# EAGLE design scheme (EAGLE 7.2.0)

## Sheet 1 of 2
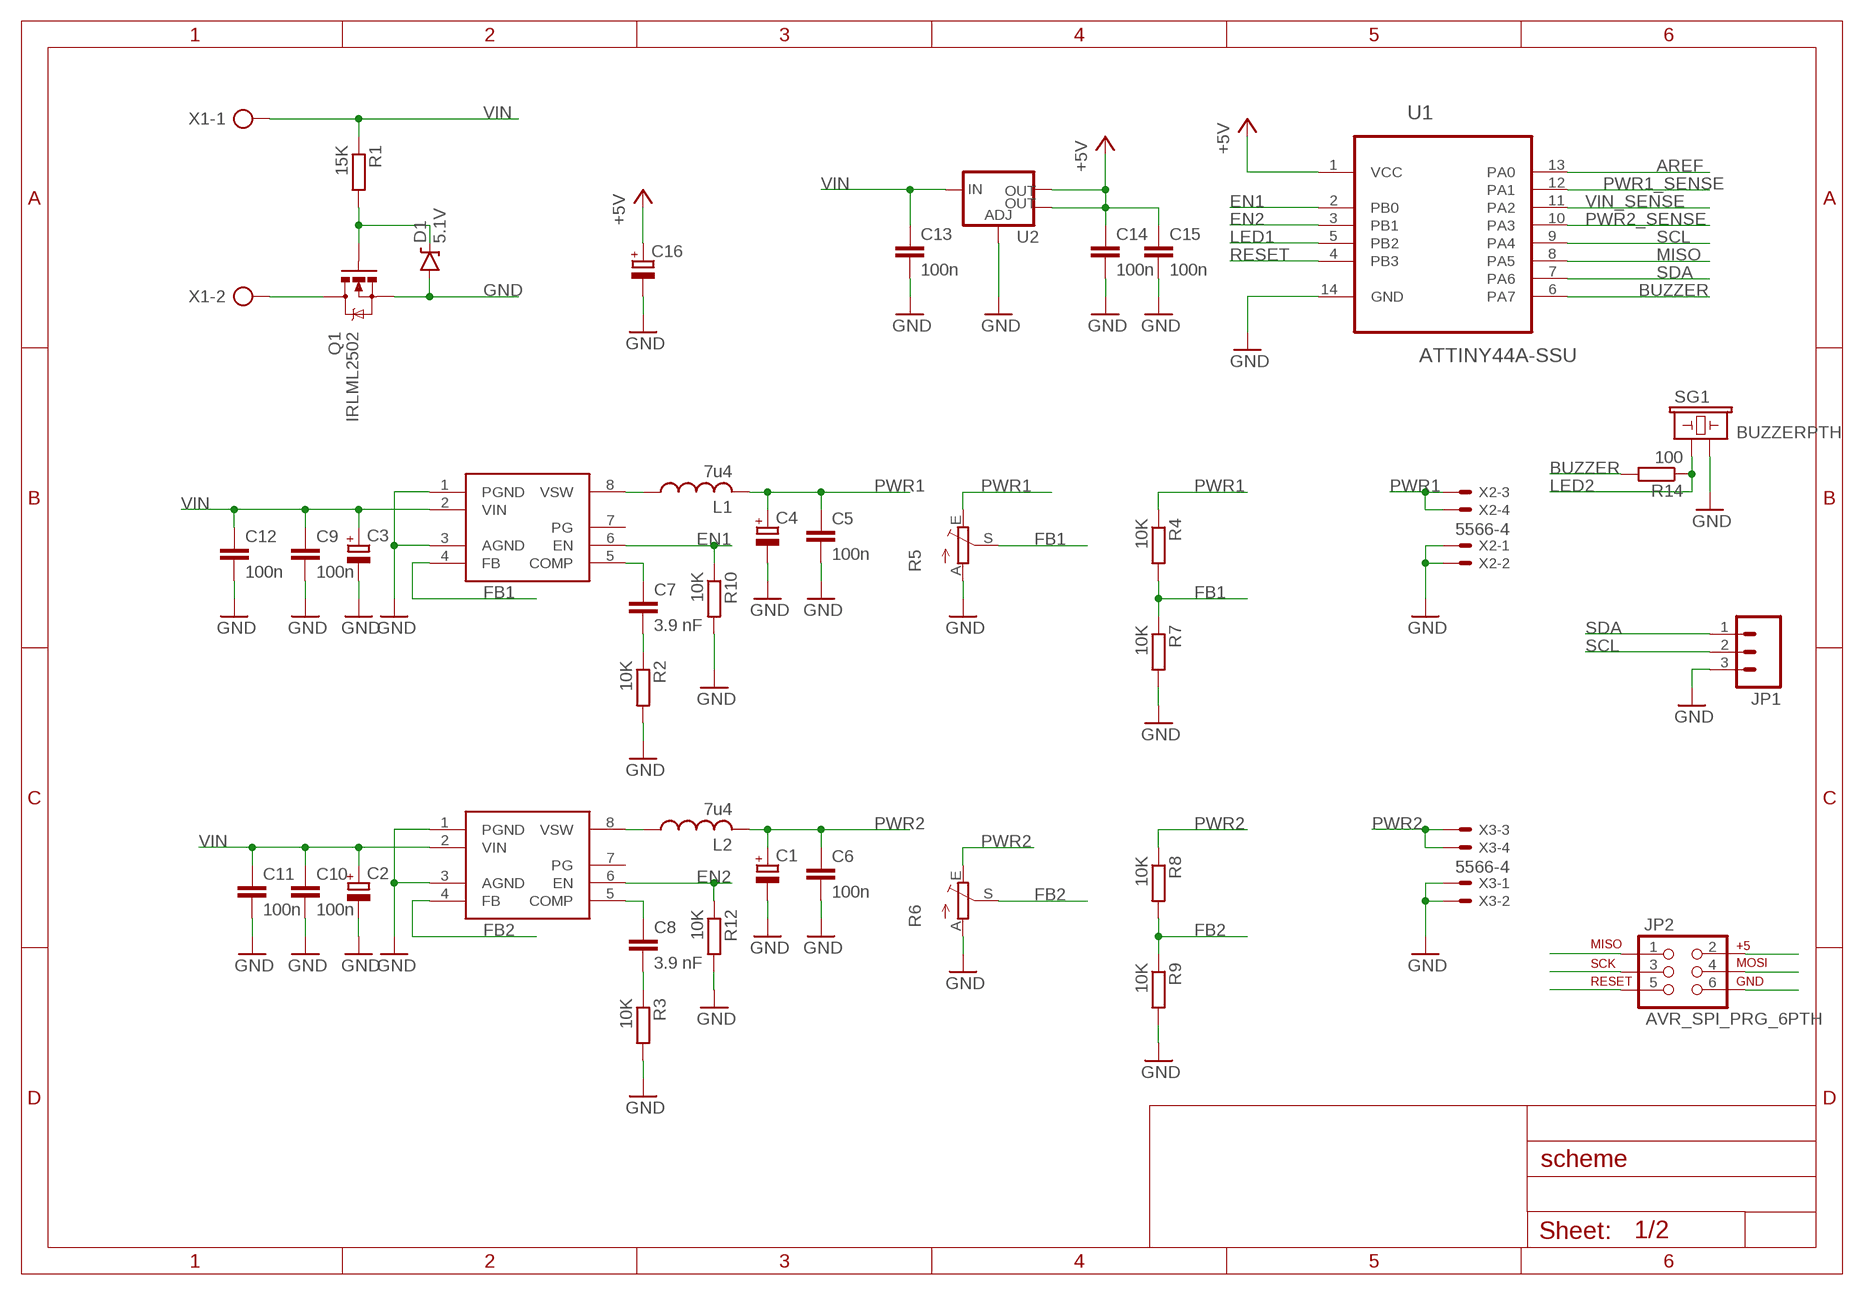
[diagram p0: schematic, sheet 1]

### Parts
C1  CPOL-EUD/7343-31R  [D/7343-31R]
C2  CPOL-EUD/7343-31R  [D/7343-31R]
C3  CPOL-EUD/7343-31R  [D/7343-31R]
C4  CPOL-EUD/7343-31R  [D/7343-31R]
C5  100n  C-EUC0805  [C0805]
C6  100n  C-EUC0805  [C0805]
C7  3.9 nF  C-EUC0805  [C0805]
C8  3.9 nF  C-EUC0805  [C0805]
C9  100n  C-EUC0805  [C0805]
C10  100n  C-EUC0805  [C0805]
C11  100n  C-EUC0805  [C0805]
C12  100n  C-EUC0805  [C0805]
C13  100n  C-EUC0805  [C0805]
C14  100n  C-EUC0805  [C0805]
C15  100n  C-EUC0805  [C0805]
C16  CPOL-EUD/7343-31R  [D/7343-31R]
D1  5.1V  DIODE-ZENER5.6V  [SOD-323]
JP1  M03PTH  [1X03]
JP2  AVR_SPI_PRG_6PTH  [2X3]
L1  7u4  L-USCDRH6D38  [CDRH6D38]
L2  7u4  L-USCDRH6D38  [CDRH6D38]
Q1  IRLML2502  MOSFET-NCHANNELAO3404A  [SOT23-3]
R1  15K  R-EU_R0805  [R0805]
R2  10K  R-EU_R0805  [R0805]
R3  10K  R-EU_R0805  [R0805]
R4  10K  R-EU_R0805  [R0805]
R5  TRIM_EU-RJ9W  [RJ9W]
R6  TRIM_EU-RJ9W  [RJ9W]
R7  10K  R-EU_R0805  [R0805]
R8  10K  R-EU_R0805  [R0805]
R9  10K  R-EU_R0805  [R0805]
R10  10K  R-EU_R0805  [R0805]
R12  10K  R-EU_R0805  [R0805]
R14  100  R-EU_R0805  [R0805]
SG1  BUZZERPTH  [BUZZER-12MM]
U1  ATTINY44A-SSU  [SOIC127P600X175-14N]
U2  V_REG_LM1117SOT223  [SOT223]
U$1  NCP3170  [SO08]
U$2  NCP3170  [SO08]
X1  AK500/2  [AK500/2]
X2  5566-4  [5566-4]
X3  5566-4  [5566-4]

### Nets
+5V: C14.1 C15.1 C16.+ JP2.2 U1.1(VCC) U2.2(OUT) U2.4(OUT) ; also sheet 2
AREF: U1.13(PA0) ; also sheet 2
BUZZER: R14.2 U1.6(PA7)
EN1: R10.1 U1.2(PB0) U$2.6(EN)
EN2: R12.1 U1.3(PB1) U$1.6(EN)
FB1: R4.2 R5.S R7.1 U$2.4(FB)
FB2: R6.S R8.2 R9.1 U$1.4(FB)
GND: C1.- C2.- C3.- C4.- C5.2 C6.2 C9.2 C10.2 C11.2 C12.2 C13.2 C14.2 C15.2 C16.- D1.A JP1.3 JP2.6 Q1.2(S) R2.2 R3.2 R5.A R6.A R7.2 R9.2 R10.2 R12.2 SG1.- U1.14(GND) U2.1(ADJ) U$1.1(PGND) U$1.3(AGND) U$2.1(PGND) U$2.3(AGND) X2.1 X2.2 X3.1 X3.2 ; also sheet 2
LED1: U1.5(PB2) ; also sheet 2
LED2: R14.1 SG1.+ ; also sheet 2
MISO: JP2.1 U1.8(PA5) ; also sheet 2
N$1: Q1.3(D) X1.2
N$2: L1.1 U$2.8(VSW)
N$3: D1.C Q1.1(G) R1.2
N$4: L2.1 U$1.8(VSW)
N$5: C7.1 U$2.5(COMP)
N$6: C8.1 U$1.5(COMP)
N$7: C7.2 R2.1
N$8: C8.2 R3.1
PWR1: C4.+ C5.1 L1.2 R4.1 R5.E X2.3 X2.4 ; also sheet 2
PWR1_SENSE: U1.12(PA1) ; also sheet 2
PWR2: C1.+ C6.1 L2.2 R6.E R8.1 X3.3 X3.4 ; also sheet 2
PWR2_SENSE: U1.10(PA3) ; also sheet 2
RESET: JP2.5 U1.4(PB3)
SCL: JP1.2 JP2.3 U1.9(PA4)
SDA: JP1.1 JP2.4 U1.7(PA6)
VIN: C2.+ C3.+ C9.1 C10.1 C11.1 C12.1 C13.1 R1.1 U2.3(IN) U$1.2(VIN) U$2.2(VIN) X1.1 ; also sheet 2
VIN_SENSE: U1.11(PA2) ; also sheet 2
Unconnected: U$1.7(PG) U$2.7(PG)

## Sheet 2 of 2
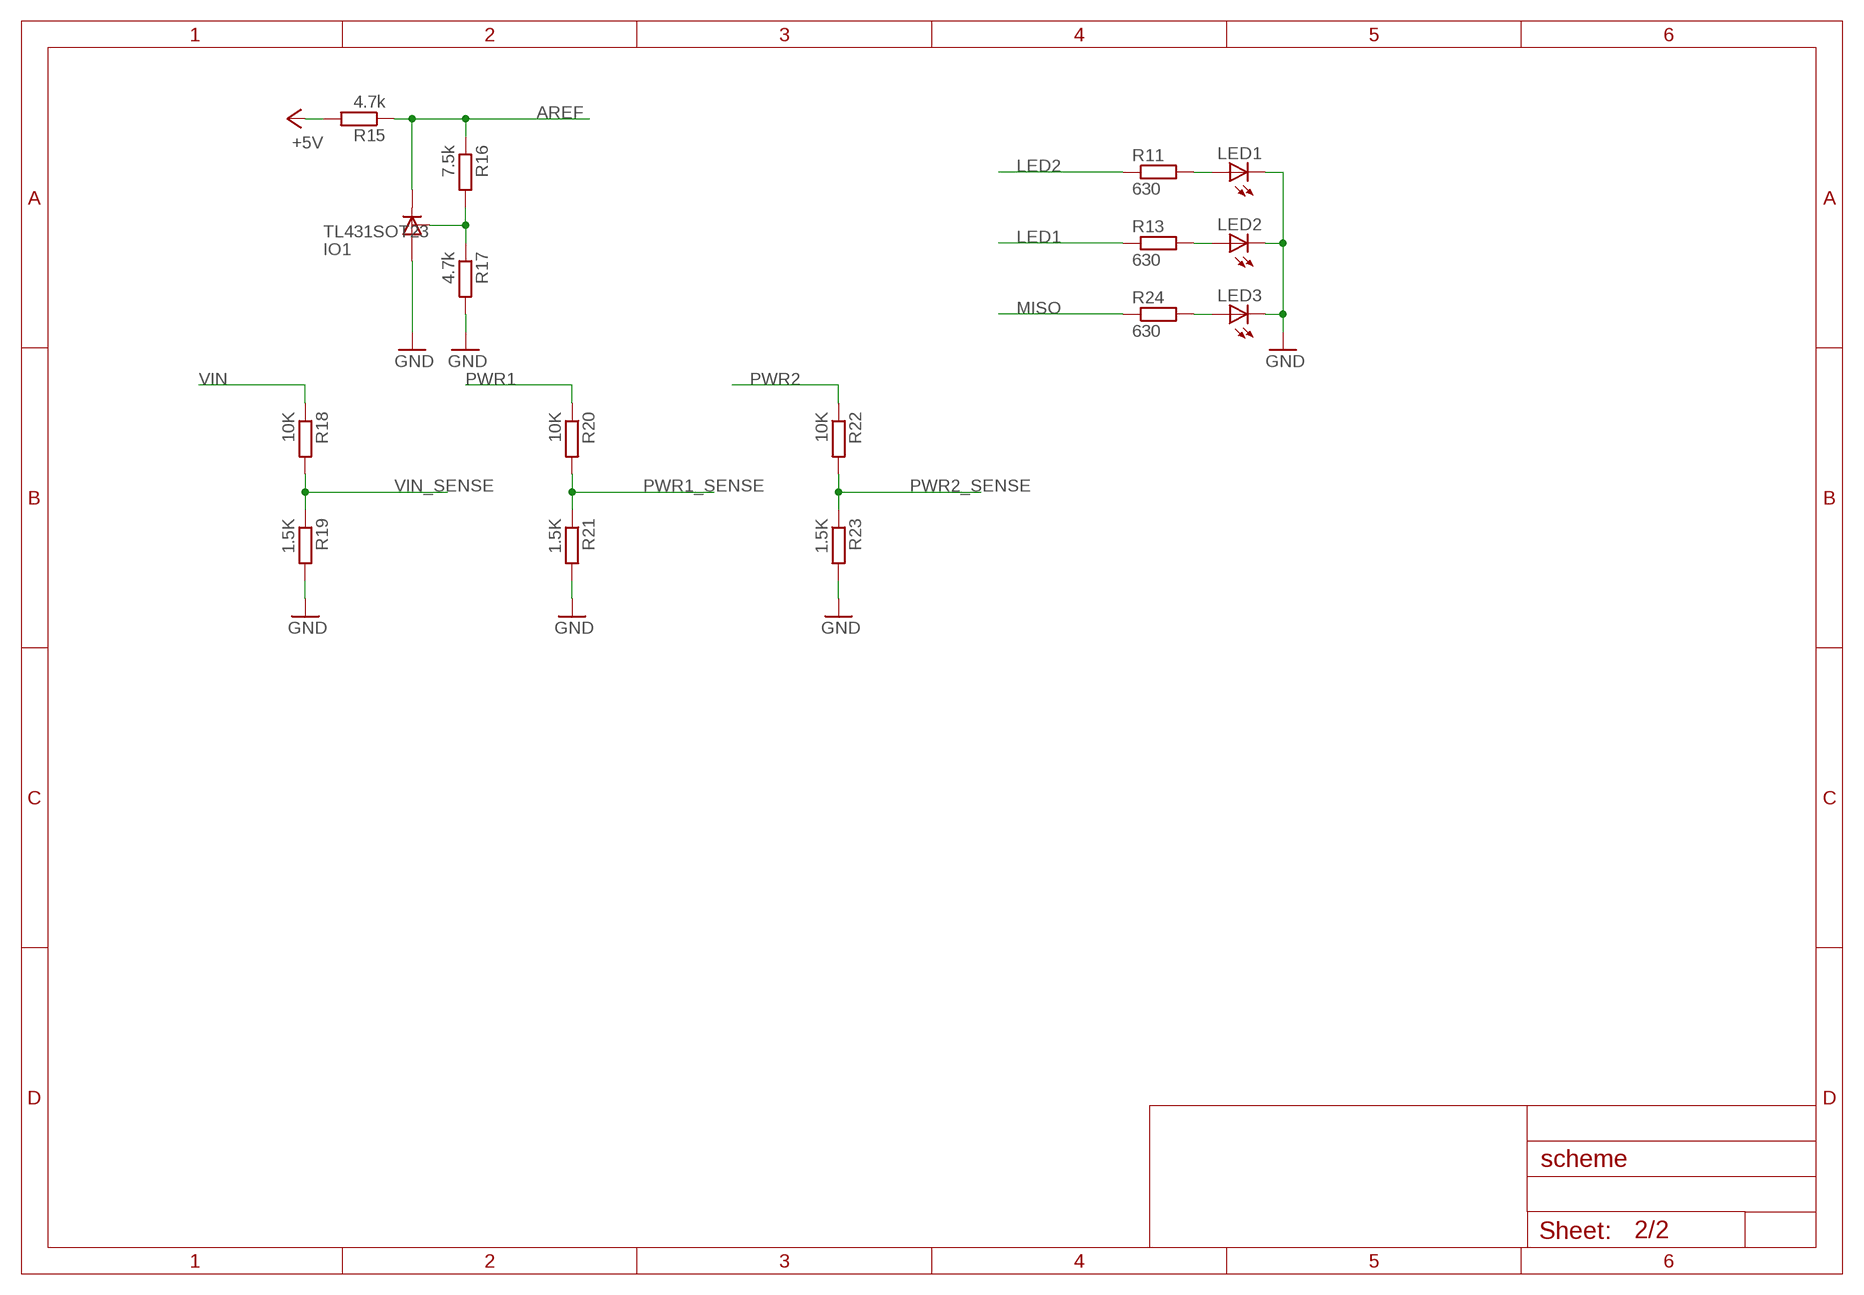
[diagram p1: schematic, sheet 2]

### Parts
IO1  TL431SOT23  [SOT23]
LED1  LEDCHIPLED_0805  [CHIPLED_0805]
LED2  LEDCHIPLED_0805  [CHIPLED_0805]
LED3  LEDCHIPLED_0805  [CHIPLED_0805]
R11  630  R-EU_R0805  [R0805]
R13  630  R-EU_R0805  [R0805]
R15  4.7k  R-EU_R0805  [R0805]
R16  7.5k  R-EU_R0805  [R0805]
R17  4.7k  R-EU_R0805  [R0805]
R18  10K  R-EU_R0805  [R0805]
R19  1.5K  R-EU_R0805  [R0805]
R20  10K  R-EU_R0805  [R0805]
R21  1.5K  R-EU_R0805  [R0805]
R22  10K  R-EU_R0805  [R0805]
R23  1.5K  R-EU_R0805  [R0805]
R24  630  R-EU_R0805  [R0805]

### Nets
+5V: R15.2 ; also sheet 1
AREF: IO1.1(C) R15.1 R16.1 ; also sheet 1
GND: IO1.3(A) LED1.C LED2.C LED3.C R17.2 R19.2 R21.2 R23.2 ; also sheet 1
LED1: R13.1 ; also sheet 1
LED2: R11.1 ; also sheet 1
MISO: R24.1 ; also sheet 1
N$10: LED1.A R11.2
N$11: IO1.2(R) R16.2 R17.1
N$12: LED2.A R13.2
N$13: LED3.A R24.2
PWR1: R20.1 ; also sheet 1
PWR1_SENSE: R20.2 R21.1 ; also sheet 1
PWR2: R22.1 ; also sheet 1
PWR2_SENSE: R22.2 R23.1 ; also sheet 1
VIN: R18.1 ; also sheet 1
VIN_SENSE: R18.2 R19.1 ; also sheet 1

## Library data of the parts
C1-C4 C16 = rcl:CPOL-EU: POLARIZED CAPACITOR, European symbol
C5-C15 = rcl:C-EU: CAPACITOR, European symbol
D1 = SparkFun-DiscreteSemi:DIODE-ZENER: Zener Diode Production Part - 8199 3.4V Zener Voltage; PROD_ID: DIO-12442; VALUE: 5.6V
IO1 = references:TL431: Programmable Shunt Regulator TL431 Features > Programmable Output Voltage to 36 Volts > Low Dynamic Output Impedance 0.2? Typical > Sink Current Capability of 1.0 to 100mA > Equivalent Full-Range Temperature Coefficient of 50ppm/°C Typical > Temperature Compensated For Operation Over Full Rated Operating Temperature Range > Low Output Noise Voltage > Fast Turn-on Response; MPN: TL431BFDT; OC_FARNELL: 2095471; PACKAGE: SOT23; SUPPLIER: NXP
JP1 = SparkFun-Connectors:M03: Header 3 Standard 3-pin 0.1" header. Use with straight break away headers (SKU : PRT-00116), right angle break away headers (PRT-00553), swiss pins (PRT-00743), machine pins (PRT-00117), and female headers (PRT-00115). Molex polarized connector foot print use with SKU : PRT-08232 with associated crimp pins and housings.
JP2 = SparkFun-Connectors:AVR_SPI_PRG_6: AVR ISP 6 Pin This is the reduced ISP connector for AVR programming. Common on Arduino. This footprint will take up less PCB space and can be used with a 10-pin to 6-pin adapter such as SKU: BOB-08508 **Special note about "TEST_POINT" package. The stop mask is on the top side, so if you want your programming test points to be on the bottom of your board, make sure to place this package on the bottom side of the board. This also ensure that the orientation to program from the bottom side will be correct.
L1 L2 = rokkit:L-US: INDUCTOR, American symbol
LED1-LED3 = led:LED: LED OSRAM: - CHIPLED LG R971, LG N971, LY N971, LG Q971, LY Q971, LO R971, LY R971 LH N974, LH R974 LS Q976, LO Q976, LY Q976 LO Q996 - Hyper CHIPLED LW Q18S LB Q993, LB Q99A, LB R99A - SideLED LS A670, LO A670, LY A670, LG A670, LP A670 LB A673, LV A673, LT A673, LW A673 LH A674 LY A675 LS A676, LA A676, LO A676, LY A676, LW A676 LS A679, LY A679, LG A679 - Hyper Micro SIDELED® LS Y876, LA Y876, LO Y876, LY Y876 LT Y87S - SmartLED LW L88C, LW L88S LB L89C, LB L89S, LG L890 LS L89K, LO L89K, LY L89K LS L896, LA L896, LO L896, LY L896 - TOPLED LS T670, LO T670, LY T670, LG T670, LP T670 LSG T670, LSP T670, LSY T670, LOP T670, LYG T670 LG T671, LOG T671, LSG T671 LB T673, LV T673, LT T673, LW T673 LH T674 LS T676, LA T676, LO T676, LY T676, LB T676, LH T676, LSB T676, LW T676 LB T67C, LV T67C, LT T67C, LS T67K, LO T67K, LY T67K, LW E67C LS E67B, LA E67B, LO E67B, LY E67B, LB E67C, LV E67C, LT E67C LW T67C LS T679, LY T679, LG T679 LS T770, LO T770, LY T770, LG T770, LP T770 LB T773, LV T773, LT T773, LW T773 LH T774 LS E675, LA E675, LY E675, LS T675 LS T776, LA T776, LO T776, LY T776, LB T776 LHGB T686 LT T68C, LB T68C - Hyper Mini TOPLED® LB M676 - Mini TOPLED Santana® LG M470 LS M47K, LO M47K, LY M47K Source: http://www.osram.convergy.de LUXEON: - LUMILED® LXK2-PW12-R00, LXK2-PW12-S00, LXK2-PW14-U00, LXK2-PW14-V00 LXK2-PM12-R00, LXK2-PM12-S00, LXK2-PM14-U00 LXK2-PE12-Q00, LXK2-PE12-R00, LXK2-PE12-S00, LXK2-PE14-T00, LXK2-PE14-U00 LXK2-PB12-K00, LXK2-PB12-L00, LXK2-PB12-M00, LXK2-PB14-N00, LXK2-PB14-P00, LXK2-PB14-Q00 LXK2-PR12-L00, LXK2-PR12-M00, LXK2-PR14-Q00, LXK2-PR14-R00 LXK2-PD12-Q00, LXK2-PD12-R00, LXK2-PD12-S00 LXK2-PH12-R00, LXK2-PH12-S00 LXK2-PL12-P00, LXK2-PL12-Q00, LXK2-PL12-R00 Source: www.luxeon.com KINGBRIGHT: KA-3528ASYC Source: www.kingbright.com
Q1 = SparkFun-DiscreteSemi:MOSFET-NCHANNEL: Common NMOSFET Parts MFG P/N Store ID Prod ID FDD8780 TRANS-09984 SI7820DN TRANS-11055 FDS6630A IC-08089 2N7002PW TRANS-11151 FQP30N06L COM-10213 TRANS-10060 BSS123LT1G TRANS-08345 BSS138 TRANS-00830 BS170 2N7000; PROD_ID: TRAN-12988
R1-R4 R7-R24 = rcl:R-EU_: RESISTOR, European symbol
R5 R6 = pot:TRIM_EU-: POTENTIOMETER
SG1 = SparkFun-Electromechanical:BUZZER: Buzzer 12mm Spark Fun Electronics SKU : Comp-Buzzer
U1 = Atmel_By_element14_Batch_1-00:ATTINY44A-SSU: 8-bit Microcontroller with In-System Programmable Flash; MPN: ATTINY44A-SSU; OC_FARNELL: 1699397; OC_NEWARK: 80P3683; PACKAGE: SOIC-14; SUPPLIER: Atmel
U2 = SparkFun-PowerIC:V_REG_LM1117: Voltage Regulator LM1117 Standard adjustable voltage regulator but in SMD form. Spark Fun Electronics SKU : COM-00595; PROD_ID: VREG-08170
U$1 U$2 = rokkit:NCP3170
X1 = con-ptr500:AK500/2: CONNECTOR; OC_FARNELL: unknown; OC_NEWARK: unknown
X2 X3 = con-molex:5566-4: Mini FIT connector 4 pol Source: http://www.molex.com; OC_FARNELL: unknown; OC_NEWARK: unknown

## Board
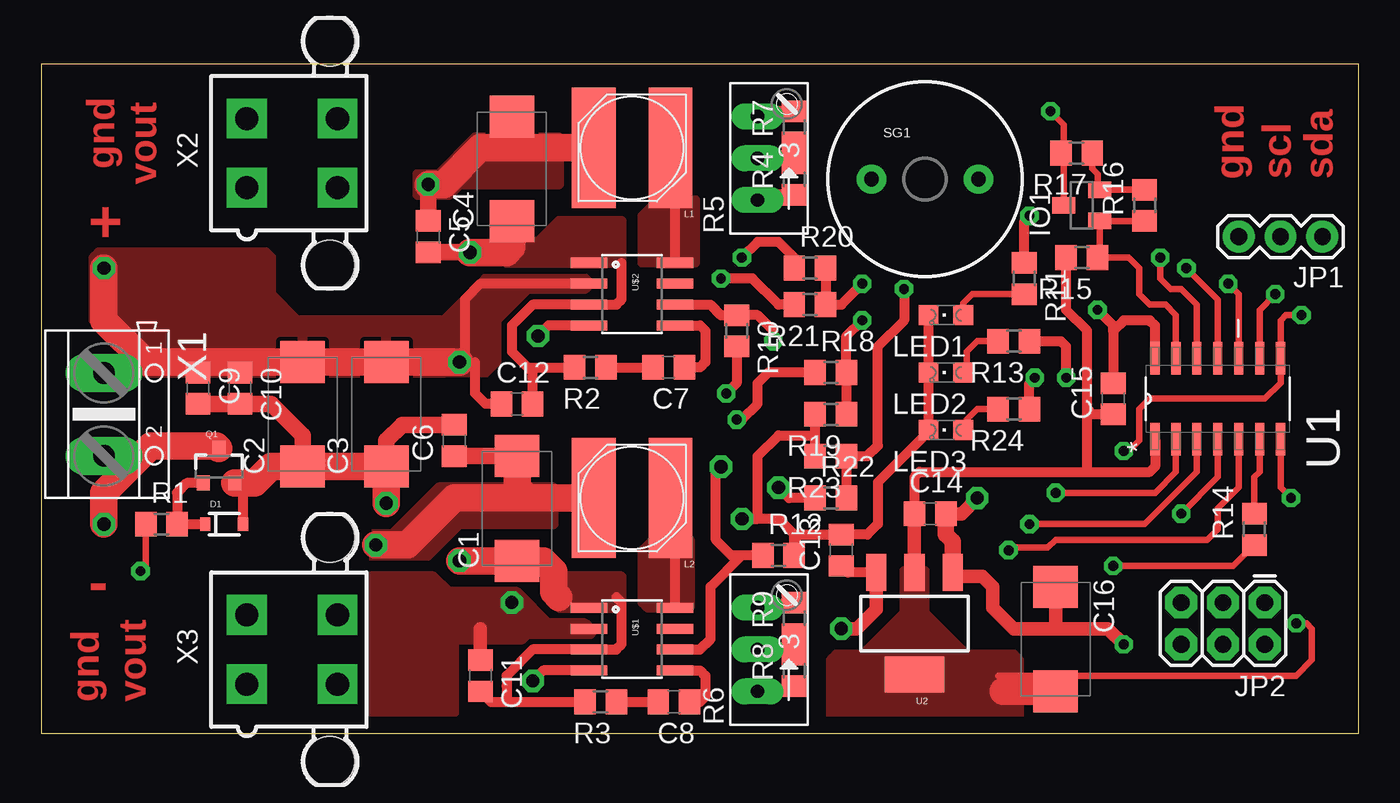
[diagram p2: board, top side]
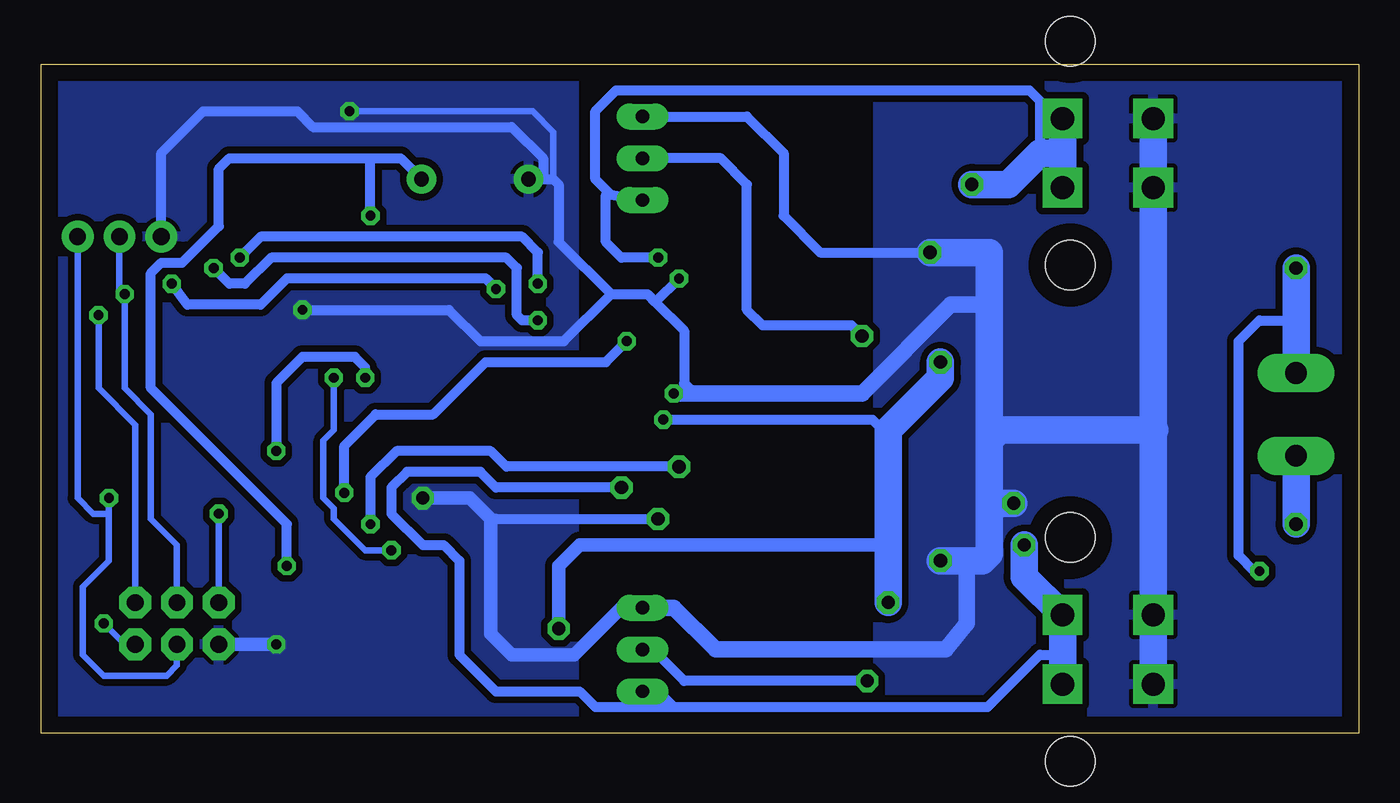
[diagram p3: board, bottom side, seen from below]

Size 80 x 40.64 mm. Coordinates in mm from the lower left corner, seen from the top.
Outline: 0,0 80,0 80,40.64 0,40.64 0,0
Copper layers (1*16): Top 0.035mm / dielectric 1.5mm / Bottom 0.035mm
Design rules "default *": minimum track width 10mil, minimum drill 24mil, track to track 8mil, track to pad 8mil, pad to pad 8mil, via to via 8mil, smd to smd 8mil, copper to edge 40mil, drill to drill 8mil, minimum pad ring 15mil, minimum via ring 10mil, stop-mask expansion 4mil, vias tented up to drill 0mil, thermal gap 10mil

### Footprints (pad centres in the part's own frame; a part is rotated, then mirrored left to right if it is on the bottom)
D/7343-31R = smd 2.55 x 2.7: + 3.175,0; - -3.175,0
C0805 = smd 1.3 x 1.5: 1 -0.95,0; 2 0.95,0
SOD-323 = smd 0.63 x 0.83: A 1.15,0; C -1.15,0
SOT23 = smd 1 x 1.4: 1 -0.95,-1.1; 2 0.95,-1.1; 3 0,1.1
1X03 = drill 1.016 pad 1.88: 1 0,0; 2 2.54,0; 3 5.08,0
2X3 = drill 1.016 pad 1.88 octagon: 1 0,0; 2 0,2.54; 3 2.54,0; 4 2.54,2.54; 5 5.08,0; 6 5.08,2.54
CDRH6D38 = smd 2.65 x 7.3: 1 -2.325,0; 2 2.325,0
CHIPLED_0805 = smd 1.2 x 1.2: A 0,-1.05; C 0,1.05
SOT23-3 = smd 0.8 x 0.9: 1 -0.95,-1; 2 0.95,-1; 3 0,1.1
R0805 = smd 1.3 x 1.5: 1 -0.95,0; 2 0.95,0
RJ9W = drill 0.813 long: A 2.54,0.635; E -2.54,0.635; S 0,0.635
BUZZER-12MM = drill 0.9 pad 1.778: + 3.25,0; - -3.25,0
SOIC127P600X175-14N = smd 1.981 x 0.559: 1 -2.464,3.81; 2 -2.464,2.54; 3 -2.464,1.27; 4 -2.464,0; 5 -2.464,-1.27; 6 -2.464,-2.54; 7 -2.464,-3.81; 8 2.464,-3.81; 9 2.464,-2.54; 10 2.464,-1.27; 11 2.464,0; 12 2.464,1.27; 13 2.464,2.54; 14 2.464,3.81
SOT223 = smd 1.219 x 2.235: 1 -2.311,-3.099; 2 0,-3.099; 3 2.311,-3.099 | smd 3.6 x 2.2: 4 0,3.099
SO08 = smd 0.61 x 2.21: 1 -1.905,-2.616; 2 -0.635,-2.616; 3 0.635,-2.616; 4 1.905,-2.616; 5 1.905,2.616; 6 0.635,2.616; 7 -0.635,2.616; 8 -1.905,2.616
AK500/2 = drill 1.321 long: 1 -2.515,0; 2 2.515,0
5566-4 = drill 1.4 square: 1 2.1,-2.75; 2 -2.1,-2.75; 3 2.1,2.75; 4 -2.1,2.75 | hole 3: 6.8,2.29; -6.8,2.29

### Placement (x,y rotation side)
C1  28.89,13.65 90 top
C2  15.88,19.37 90 top
C3  20.95,19.37 90 top
C4  28.57,34.29 90 top
C5  23.5,30.16 270 top
C6  25.08,17.78 90 top
C7  38.1,22.22 180 top
C8  38.42,1.9 180 top
C9  9.53,20.95 270 top
C10  12.06,20.95 270 top
C11  26.67,3.49 270 top
C12  28.89,20 0 top
C13  48.58,11.11 90 top
C14  53.98,13.34 0 top
C15  65.09,20.32 90 top
C16  61.59,5.71 270 top
D1  11.11,12.7 0 top
IO1  63.18,32.07 90 top
JP1  77.79,30.16 180 top
JP2  74.3,7.94 180 top
L1  35.88,35.56 180 top
L2  35.88,14.29 180 top
LED1  54.93,25.4 90 top
LED2  54.93,21.91 90 top
LED3  54.93,18.41 90 top
Q1  10.79,16.19 0 top
R1  7.3,12.7 0 top
R2  33.34,22.22 180 top
R3  33.97,1.9 180 top
R4  45.72,33.66 90 top
R5  44.13,34.93 90 top
R6  44.13,5.08 90 top
R7  45.72,36.83 90 top
R8  45.72,3.81 90 top
R9  45.72,6.99 90 top
R10  42.23,24.45 270 top
R11  59.69,27.62 270 top
R12  44.77,10.79 0 top
R13  59.05,23.81 180 top
R14  73.66,12.38 90 top
R15  63.18,28.89 180 top
R16  66.99,32.07 90 top
R17  62.87,35.24 180 top
R18  47.94,21.91 0 top
R19  47.94,19.37 180 top
R20  46.67,28.26 0 top
R21  46.67,26.04 180 top
R22  47.94,14.29 0 top
R23  47.94,16.83 180 top
R24  59.05,19.68 180 top
SG1  53.66,33.66 0 top
U1  71.44,20.32 90 top
U2  53.02,6.67 180 top
U$1  35.88,5.71 270 top
U$2  35.88,26.67 270 top
X1  3.81,19.37 270 top
X2  15.24,35.24 270 top
X3  15.24,5.08 270 top

### Tracks (layer width: path | path; a pad name or v marks a point on that pad's centre or on a via)
+5V  (via drill 0.6)
  Top 0.406: v76.2,6.67 76.83,6.67 77.15,6.35 77.15,4.45 76.2,3.49 58.1,3.49 | C14.1
  Top 0.61: U1.1 67.63,16.19 67.31,15.87 63.5,15.87 | C14.1 53.02,15.56 53.34,15.87 63.5,15.87 | C15.1 63.81,19.37 63.5,19.68 | 63.5,19.68 63.5,24.45 62.23,25.72 R15.2 | 63.5,15.87 63.5,19.68
  Top 0.813: U2.2 C14.1
  Top 1.676: C16.+ 58.42,2.54
  Bottom 0.406: JP2.2 74.93,5.4 v76.2,6.67
  pour Top (no thermals): 52.39,9.84 52.39,7.3 49.85,4.76 48.26,4.76 47.94,4.45 47.94,0.95 59.37,0.95 59.37,4.45 59.05,4.76 56.2,4.76 53.98,6.99 53.66,7.3 53.66,9.84
AREF
  Top 0.406: R16.1 IO1.1 64.28,29.04 R15.1 66.04,28.89 66.67,28.26 66.67,26.67 67.31,26.04 68.26,26.04 68.9,25.4 U1.13
BUZZER
  Top 0.406: U1.6 73.98,15.87 73.66,15.56 R14.2
EN1  (via drill 0.6)
  Top 0.406: U1.2 68.9,15.87 67.63,14.6 v61.59,14.6
  Top 0.61: U$2.6 40.64,26.04 41.27,25.4 R10.1 43.5,25.4 44.45,24.45 v44.45,23.81
  Bottom 0.61: v61.59,14.6 61.59,17.46 59.69,19.37 56.2,19.37 53.02,22.54 45.72,22.54 v44.45,23.81
EN2  (via drill 0.6, 0.8)
  Top 0.406: v60.01,12.7 66.99,12.7 70.17,15.87 U1.3
  Top 0.61: U$1.6 40.01,5.08 40.64,5.71 40.64,8.89 42.55,10.79 | R12.1 42.55,10.79 | 42.55,10.79 41.91,10.79 40.96,11.75 40.96,15.87 v41.27,16.19
  Bottom 0.61: v41.27,16.19 51.75,16.19 52.7,17.15 58.42,17.15 60.01,15.56 v60.01,12.7
FB1  (via drill 0.8)
  Top 0.61: 33.34,24.77 U$2.4 30.8,24.77 v30.16,24.13 | R7.1 45.72,35.24 | 45.72,35.24 R4.2 | R5.S 45.72,35.24
  Bottom 0.61: v30.16,24.13 30.8,24.77 36.2,24.77 37.15,25.72 37.15,33.34 38.73,34.93 R5.S
FB2  (via drill 0.8)
  Top 0.61: U$1.4 30.48,3.81 v29.84,3.17 | R6.S 45.72,5.08 | 45.72,5.08 R8.2 | R9.1 45.72,5.08
  Bottom 0.61: v29.84,3.17 40.96,3.17 42.86,5.08 R6.S
GND  (via drill 0.6, 0.8)
  Top 0.406: R17.2 62.08,35.08 IO1.3 62.08,36.98 v61.28,37.78 | 55.58,9.52 U2.1
  Top 0.61: D1.A 12.26,14.67 Q1.2 | 34.92,8.26 35.24,7.94 35.24,5.4 34.92,5.08 U$1.3 29.84,5.08 28.26,3.49 28.26,2.86 28.25,1.91 28.26,1.9 | 28.26,1.9 R3.2 | R6.A 44.77,7.62 45.09,7.94 R9.2 | 35.24,28.58 35.24,26.35 34.92,26.04 U$2.3 29.84,26.04 28.57,24.77 28.57,23.18 29.53,22.22 | 29.53,22.22 R2.2 | R7.2 43.49,37.78 R5.A | C12.2 29.84,21.91 29.53,22.22 | U1.14 67.63,24.77 67.31,25.08 65.72,25.08 65.09,24.45 | 65.09,24.45 C15.2 | R10.2 42.23,21.27 v41.59,20.64 | C13.2 46.04,12.07 45.72,11.75 R12.2 45.72,12.07 44.77,13.02 43.5,13.02 | C13.2 50.16,12.07 50.8,12.7 50.8,15.24 53.88,18.32 LED3.C LED2.C LED1.C | C13.2 | R21.2 44.77,26.04 43.18,27.62 v41.27,27.62 | v42.55,13.02 43.5,13.02 | R23.2 46.99,18.1 | 46.99,18.1 R19.2 | 43.5,13.02 43.5,16.83 44.77,18.1 46.99,18.1 | 65.09,24.45 65.09,24.77 v64.14,25.72 | C11.2 27.3,1.9 28.26,1.9
  Top 0.813: Q1.2 | v65.72,5.4 64.77,6.35 61.59,6.35 | 61.59,6.35 59.05,6.35 57.78,7.62 57.78,8.89 57.15,9.52 55.58,9.52 | C14.2 55.88,13.34 v56.83,14.29 | C16.- 61.59,6.35
  Top 1.016: C3.- 20.95,17.78 21.91,18.73 C6.2 | C2.- 15.88,18.1 13.97,20.01 C10.2 C9.2 | C5.2 v26.03,29.21 26.35,28.89 26.67,29.21 | U2.1 55.33,11.66 54.93,12.07 C14.2
  Top 1.676: Q1.2 12.97,15.19 13.97,16.19 C2.- C3.- v20.95,13.97 | v25.4,10.48 C1.- 30.48,10.48 31.11,9.84 31.11,8.57 31.43,8.26 | C4.- 28.57,29.53 28.26,29.21 26.67,29.21 v26.04,29.21
  Bottom 0.406: v61.28,37.78 50.16,37.78 48.9,36.51 48.9,33.65
  Bottom 0.61: R5.A 37.15,37.47 34.92,35.24 34.92,31.43 32.7,29.21 26.67,29.21 26.51,29.05 26.19,29.05 v26.04,29.21 | 23.81,10.16 23.5,10.48 | SG1.- 49.53,33.65 | 49.53,33.65 48.9,33.65 48.58,33.34 48.58,29.84 45.4,26.67 | 40.32,20.64 40.96,21.27 40.96,24.45 42.7,26.19 | JP1.3 72.71,35.24 70.17,37.78 64.45,37.78 63.5,36.83 51.44,36.83 49.53,34.93 49.53,33.65 | 45.4,26.67 43.18,26.67 42.7,26.19 | v41.27,27.62 42.7,26.19 | 52.7,12.7 52.39,13.02 v42.55,13.02 | v64.14,25.72 55.24,25.72 53.34,23.81 48.26,23.81 45.4,26.67
  Bottom 0.813: JP2.6 v65.72,5.4 | v56.83,14.29 53.98,14.29 52.7,13.02 52.7,12.7 52.7,6.03 51.44,4.76 47.62,4.76 44.77,7.62 R6.A
  Bottom 1.016: R6.A 41.59,7.62 39.05,5.08 25.08,5.08 23.81,6.67 23.81,10.16 | v41.59,20.64 40.32,20.64 30.16,20.64 24.77,26.04 22.43,26.04
  Bottom 1.676: 22.43,17.78 22.43,26.04 22.43,29.21 v26.04,29.21 | 22.43,17.78 22.43,13.97 | v25.4,10.48 23.5,10.48 22.86,10.48 22.43,10.9 22.43,13.97 | v20.95,13.97 22.43,13.97 | X2.2 X2.1 X3.2 | X3.2 X3.1 | X3.2 12.49,18.31 12.38,18.42 21.8,18.42 22.43,17.78
  pour Top (no thermals): 31.43,7.62 35.24,7.62 35.24,9.53 31.11,9.53 31.11,7.94
  pour Top (no thermals): 33.34,28.57 35.24,28.57 35.24,31.11 31.43,31.11 30.16,29.84 28.26,29.84 28.26,28.57
  pour Bottom (isolate 0.406): 47.62,40.64 80.01,40.64 80.01,0 47.62,0
  pour Bottom (isolate 0.406): 0,40.64 29.21,40.64 29.21,0 0,0
LED1  (via drill 0.6)
  Top 0.406: U1.5 72.71,14.92 71.44,13.65 71.44,12.38 70.8,11.75 61.59,11.75 61.12,11.27 58.9,11.27 v58.74,11.11
  Top 0.61: R13.1 61.91,23.81 62.23,23.49 v62.23,21.59
  Bottom 0.406: v62.23,21.59 62.23,18.42 62.87,17.78 62.87,14.29 62.23,13.65 62.23,13.02 60.33,11.11 v58.74,11.11
LED2  (via drill 0.6)
  Top 0.406: R14.1 72.39,10.16 v65.09,10.16
  Top 0.61: R11.1 59.69,31.11 v60.01,31.43
  Bottom 0.61: v65.09,10.16 65.09,12.7 73.34,20.95 73.34,27.94 72.71,28.58 71.44,28.58 69.22,30.8 69.22,34.29 68.58,34.93 60.01,34.93 | 60.01,34.93 58.18,34.93 SG1.+ | v60.01,31.43 60.01,34.93
MISO  (via drill 0.6)
  Top 0.406: v76.52,25.4 75.56,25.4 75.25,25.08 U1.8 75.25,21.27 74.3,20.32 67.31,20.32 66.67,19.68 66.67,17.78 66.04,17.15 v65.72,17.15
  Top 0.61: R24.1 60.01,21.27 v60.33,21.59
  Bottom 0.406: v76.52,25.4 76.52,20.95 74.3,18.73 JP2.1
  Bottom 0.61: v60.33,21.59 60.33,22.22 60.96,22.86 64.14,22.86 65.72,21.27 v65.72,17.15
N$1  (via drill 0.8)
  Top 1.676: Q1.3 10.62,17.46 6.67,17.46 3.81,14.6 v3.81,12.7
  Bottom 1.676: X1.2 v3.81,12.7
N$2
  Top 0.61: U$2.8 38.49,35.27 L1.1
  pour Top (no thermals): 37.78,28.57 36.51,28.57 36.51,31.43 37.47,32.39 39.69,32.39 39.69,28.57
N$3
  Top 0.61: D1.C R1.2 8.26,14.6 8.84,15.19 Q1.1
  Top 0.813: Q1.1
N$4
  Top 0.61: U$1.8 38.49,14 L2.1
  pour Top (no thermals): 39.37,7.62 36.83,7.62 36.51,7.94 36.51,11.11 37.15,11.75 39.37,11.75
N$5
  Top 0.61: U$2.5 40.01,24.77 40.32,24.45 40.32,22.54 40.01,22.22 C7.1
N$6
  Top 0.61: U$1.5 40.01,3.81 40.32,3.49 40.32,2.22 40.01,1.9 C8.1
N$7
  Top 0.61: R2.1 C7.2
N$8
  Top 0.61: R3.1 C8.2
N$10
  Top 0.406: LED1.A 55.98,26.13 56.52,26.67 R11.2
  Top 0.61: R11.2
N$11
  Top 0.406: R17.1 63.81,34.29 64.14,33.97 64.14,33.16 IO1.2 R16.2
N$12
  Top 0.406: R13.2 56.83,23.81 56.2,23.18 56.2,22.13 LED2.A
N$13
  Top 0.406: R24.2 56.83,19.68 56.2,19.05 56.2,18.63 LED3.A
PWR1  (via drill 0.6, 0.8)
  Top 0.61: R4.1 43.81,32.71 R5.E | R20.1 45.72,28.89 44.77,29.84 43.5,29.84 v42.55,28.89
  Top 1.016: C5.1 23.5,32.7 24.13,33.34
  Top 1.676: L1.2 29.21,35.56 | 29.21,35.56 28.57,36.19 C4.+ | 29.21,35.56 26.67,35.56 24.45,33.34 24.13,33.34 v23.5,33.34
  Bottom 0.61: R5.E 45.4,32.7 45.56,32.86 | 45.56,32.86 46.35,33.65 46.35,37.78 45.09,39.05 20,39.05 19.37,38.42 19.37,35.24 | v42.55,28.89 44.77,28.89 45.72,29.84 R4.1 45.56,32.86
  Bottom 1.676: X2.4 17.99,35.24 | 17.99,35.24 X2.3 | v23.5,33.34 21.27,33.34 19.37,35.24 17.99,35.24
  pour Top: 31.43,36.2 31.43,33.34 25.4,33.34 24.77,32.7 22.86,32.7 22.86,33.97 24.13,33.97 26.35,36.2
PWR1_SENSE  (via drill 0.6)
  Top 0.406: v67.94,28.89 67.94,27.62 68.58,26.99 69.22,26.99 70.17,26.04 U1.12
  Top 0.61: R20.2 R21.1 48.58,26.04 v49.85,27.31
  Bottom 0.61: v49.85,27.31 49.85,29.21 50.8,30.16 66.67,30.16 v67.94,28.89
PWR2  (via drill 0.8)
  Top 0.61: R6.E 44.77,2.54 R8.1 | R22.1 45.4,14.29 v44.77,14.92
  Top 1.016: C1.+ C6.1
  Top 1.676: L2.2 29.53,14.29 | 29.53,14.29 28.89,14.92 C1.+ | 29.53,14.29 25.08,14.29 22.23,11.43 v20.32,11.43
  Bottom 0.61: R6.E 42.55,2.54 41.59,1.59 | 41.59,1.59 22.54,1.59 19.37,4.76 17.99,4.76 | v44.77,14.92 52.39,14.92 53.34,15.87 57.78,15.87 58.74,14.92 58.74,13.34 56.83,11.43 55.56,11.43 54.61,10.48 54.61,4.76 52.39,2.54 47.31,2.54 46.35,1.59 41.59,1.59
  Bottom 1.676: v20.32,11.43 20.32,9.51 X3.4 17.99,4.76 X3.3
  pour Top: 19.68,10.79 23.5,10.79 25.4,12.7 31.11,12.7 31.11,14.92 24.13,14.92 21.27,12.07 19.68,12.07
PWR2_SENSE  (via drill 0.6)
  Top 0.406: U1.10 72.71,26.67 v72.07,27.31
  Top 0.61: R22.2 R23.1 50.16,16.83 50.8,17.46 50.8,23.49 52.39,25.08 v52.39,26.99
  Bottom 0.61: v52.39,26.99 53.02,27.62 65.09,27.62 66.67,26.04 71.12,26.04 v72.07,27.31
RESET  (via drill 0.6)
  Top 0.406: U1.4 71.44,15.56 v69.22,13.34
  Bottom 0.406: v69.22,13.34 JP2.5
SCL  (via drill 0.6)
  Top 0.406: U1.9 73.98,25.72 v74.93,26.67
  Bottom 0.406: JP2.3 71.75,11.43 73.34,13.02 73.34,19.37 74.93,20.95 v74.93,26.67 75.25,26.99 JP1.2
SDA  (via drill 0.6)
  Top 0.406: U1.7 75.25,14.92 v75.88,14.29
  Bottom 0.406: v75.88,14.29 75.88,13.34 | 75.88,13.34 75.88,10.48 77.47,8.89 77.47,4.76 76.2,3.49 72.39,3.49 71.75,4.13 JP2.4 | JP1.1 77.79,14.29 76.83,13.34 75.88,13.34
VIN  (via drill 0.6, 0.8)
  Top 0.406: R1.1 6.35,10.16 v6.03,9.84
  Top 0.61: U$2.2 26.67,27.31 25.72,26.35 25.72,22.86 v25.4,22.54 | C12.1 26.99,20 26.35,20.64 26.35,22.54 | U2.3 48.97,9.77 C13.1 | R18.1 44.13,21.91 43.5,21.27 43.5,20 42.55,19.05 v42.23,19.05
  Top 0.813: C11.1 26.67,6.35 | U2.3 50.71,7.53 49.53,6.35 v48.58,6.35
  Top 1.27: C10.1 12.06,22.54 | C9.1 9.53,22.54
  Top 1.676: v3.81,28.26 3.81,25.08 6.35,22.54 9.53,22.54 12.06,22.54 C2.+ C3.+ v25.4,22.54
  Bottom 0.406: 4.13,24.45 3.81,24.77
  Bottom 0.61: v42.23,19.05 29.53,19.05 28.57,18.1 | v6.03,9.84 6.35,9.84 7.3,10.79 7.3,23.81 6.03,25.08 4.13,25.08 3.81,25.4
  Bottom 0.813: v48.58,6.35 C13.1 47.31,11.43 28.89,11.43 28.57,11.75
  Bottom 1.676: X1.1 3.81,24.77 3.81,25.4 v3.81,28.26 | v28.57,7.94 28.57,11.75 28.57,18.1 28.57,18.42 25.4,21.59 v25.4,22.54
  pour Top (no thermals): 33.34,27.3 33.02,26.99 29.53,26.99 27.62,25.08 27.62,22.54 26.99,21.91 24.45,21.91 24.45,25.08 26.99,27.62 33.02,27.62
  pour Top: 3.17,28.89 3.17,25.08 6.35,21.91 24.45,21.91 24.45,25.08 15.56,25.08 13.97,26.67 13.97,28.89 13.65,29.21 3.49,29.21
  pour Top (no thermals): 33.66,6.35 33.34,6.35 33.02,6.67 30.8,6.67 28.89,8.57 24.77,8.57 23.81,9.53 20,9.53 20,1.27 25.08,1.27 25.08,5.71 29.21,5.71 29.53,6.03 33.34,6.03
VIN_SENSE  (via drill 0.6)
  Top 0.406: v69.53,28.26 71.44,26.35 U1.11
  Top 0.61: R19.1 R18.2 48.89,24.13 v49.85,25.08
  Bottom 0.61: v49.85,25.08 50.8,25.08 51.12,25.4 51.12,28.26 51.75,28.89 66.04,28.89 67.63,27.31 68.58,27.31 v69.53,28.26

### Text on the board
Top: gnd | vout | gnd | scl | sda | + | - | gnd | vout